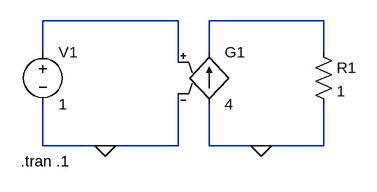
[diagram p0: schematic Draft9.asc]
Draft9.asc, the LTspice schematic file:
Version 4
SHEET 1 880 680
WIRE 192 80 -16 80
WIRE 416 80 240 80
WIRE -16 128 -16 80
WIRE 240 128 240 80
WIRE 416 128 416 80
WIRE 192 144 192 80
WIRE -16 272 -16 208
WIRE 80 272 -16 272
WIRE 192 272 192 192
WIRE 192 272 80 272
WIRE 240 272 240 208
WIRE 320 272 240 272
WIRE 416 272 416 208
WIRE 416 272 320 272
FLAG 80 272 0
FLAG 320 272 0
SYMBOL voltage -16 112 R0
SYMATTR InstName V1
SYMATTR Value 1
SYMBOL g 240 112 R0
SYMATTR InstName G1
SYMATTR Value 4
SYMBOL res 400 112 R0
SYMATTR InstName R1
SYMATTR Value 1
TEXT -50 296 Left 2 !.tran .1

The netlist it stands for:
* Draft9.asc
V1 N001 0 1
G1 0 N002 N001 0 4
R1 N002 0 1
.tran .1
.backanno
.end